# Altium schematic sheet 03 Block_Diagram.SchDoc: CM4 IO
size 420 x 297 mm; Page Create Date: March  8, 1995; Page Number: 3; Page Size: A3; Comment: radxa_1010; Page Count: 19; RevCode: V1.10; Doc: 03 Block_Diagram; DsnPath: D:\WMS\黄工\[RC126]CM4_IO_V1.10\[RC126]_V1.10\CM4 IO_V1.10.DSN; SchematicName: CM4 IO V1.10; PageName: 03 Block_Diagram; PageSize: A3; TopSchematic: True
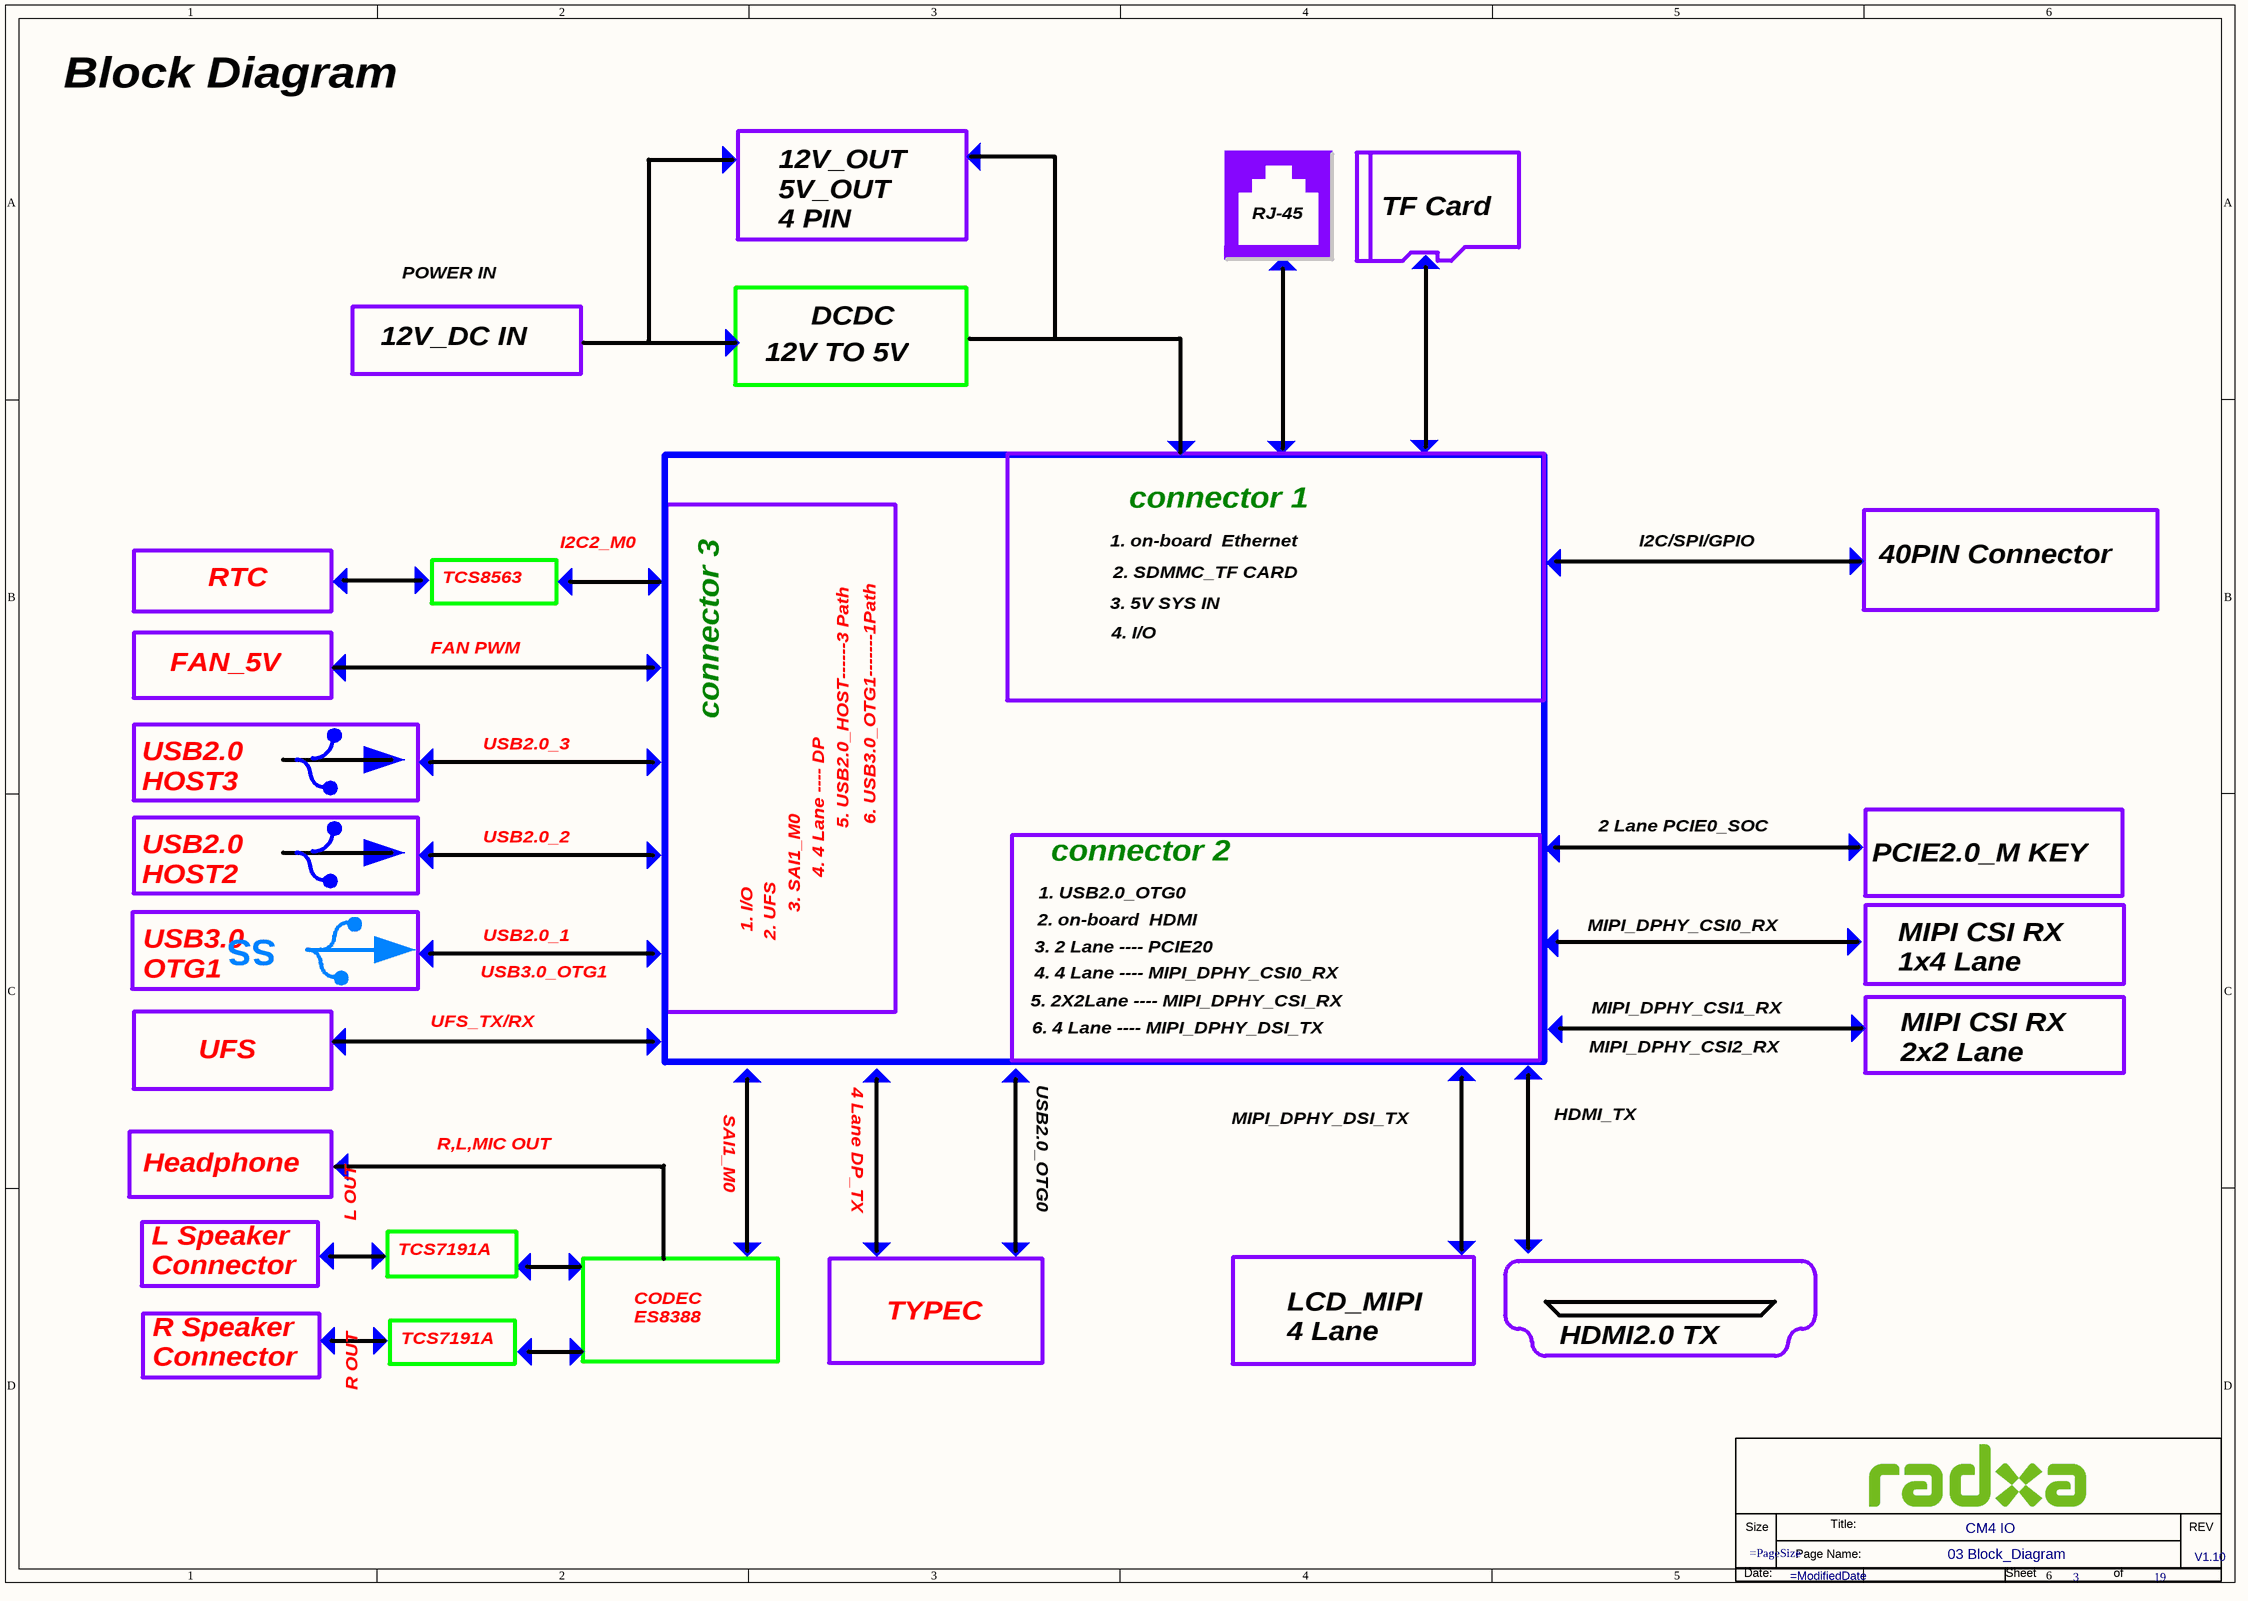
[diagram p0: 03 Block_Diagram.SchDoc]

## Parts
*  Doc: 03 Block_Diagram  RevCode: V1.10  Title: CM4 IO  Page Number: 3  Page Count: 19  (hidden comment: radxa_1010)  (graphical)

## Notes on the sheet
- Block Diagram
- 12V_OUT
  5V_OUT
  4 PIN
- RJ-45
- TF Card
- 12V_DC IN
- POWER IN
- DCDC
- 12V TO 5V
- connector 1
- RTC
- TCS8563
- I2C2_M0
- 1. on-board  Ethernet
- 2. SDMMC_TF CARD
- I2C/SPI/GPIO
- 40PIN Connector
- FAN PWM
- 3. 5V SYS IN
- 4. I/O
- USB2.0
  HOST3
- FAN_5V
- USB2.0_3
- connector 3
- USB2.0
  HOST2
- USB2.0_2
- 5. USB2.0_HOST------3 Path
- 6. USB3.0_OTG1-------1Path
- connector 2
- 2 Lane PCIE0_SOC
- PCIE2.0_M KEY
- USB3.0
  OTG1
- SS
- USB2.0_1
- 1. I/O
- 2. UFS
- 3. SAI1_M0
- 4. 4 Lane ---- DP
- 2. on-board  HDMI
- 1. USB2.0_OTG0
- MIPI_DPHY_CSI0_RX
- MIPI CSI RX
  1x4 Lane
- USB3.0_OTG1
- 4. 4 Lane ---- MIPI_DPHY_CSI0_RX
- 3. 2 Lane ---- PCIE20
- MIPI CSI RX
  2x2 Lane
- UFS
- UFS_TX/RX
- 5. 2X2Lane ---- MIPI_DPHY_CSI_RX
- 6. 4 Lane ---- MIPI_DPHY_DSI_TX
- MIPI_DPHY_CSI2_RX
- MIPI_DPHY_CSI1_RX
- SAI1_M0
- 4 Lane DP_TX
- USB2.0_OTG0
- MIPI_DPHY_DSI_TX
- HDMI_TX
- Headphone
- R,L,MIC OUT
- L Speaker
  Connector
- L OUT
- TCS7191A
- R Speaker
  Connector
- CODEC
  ES8388
- TYPEC
- LCD_MIPI
  4 Lane
- R OUT
- HDMI2.0 TX
- (in symbol radxa_1010) Size; Title:; REV; Page Name:; Date:; Sheet; of

## Library data of the parts
* = radxa_1010: Page Create Date: March  8, 1995; Page Size: =PageSize; Page Modify Date: =ModifiedDate